# Altium schematic sheet main.SchDoc
size 581 x 513 mm; Origin: Eagle
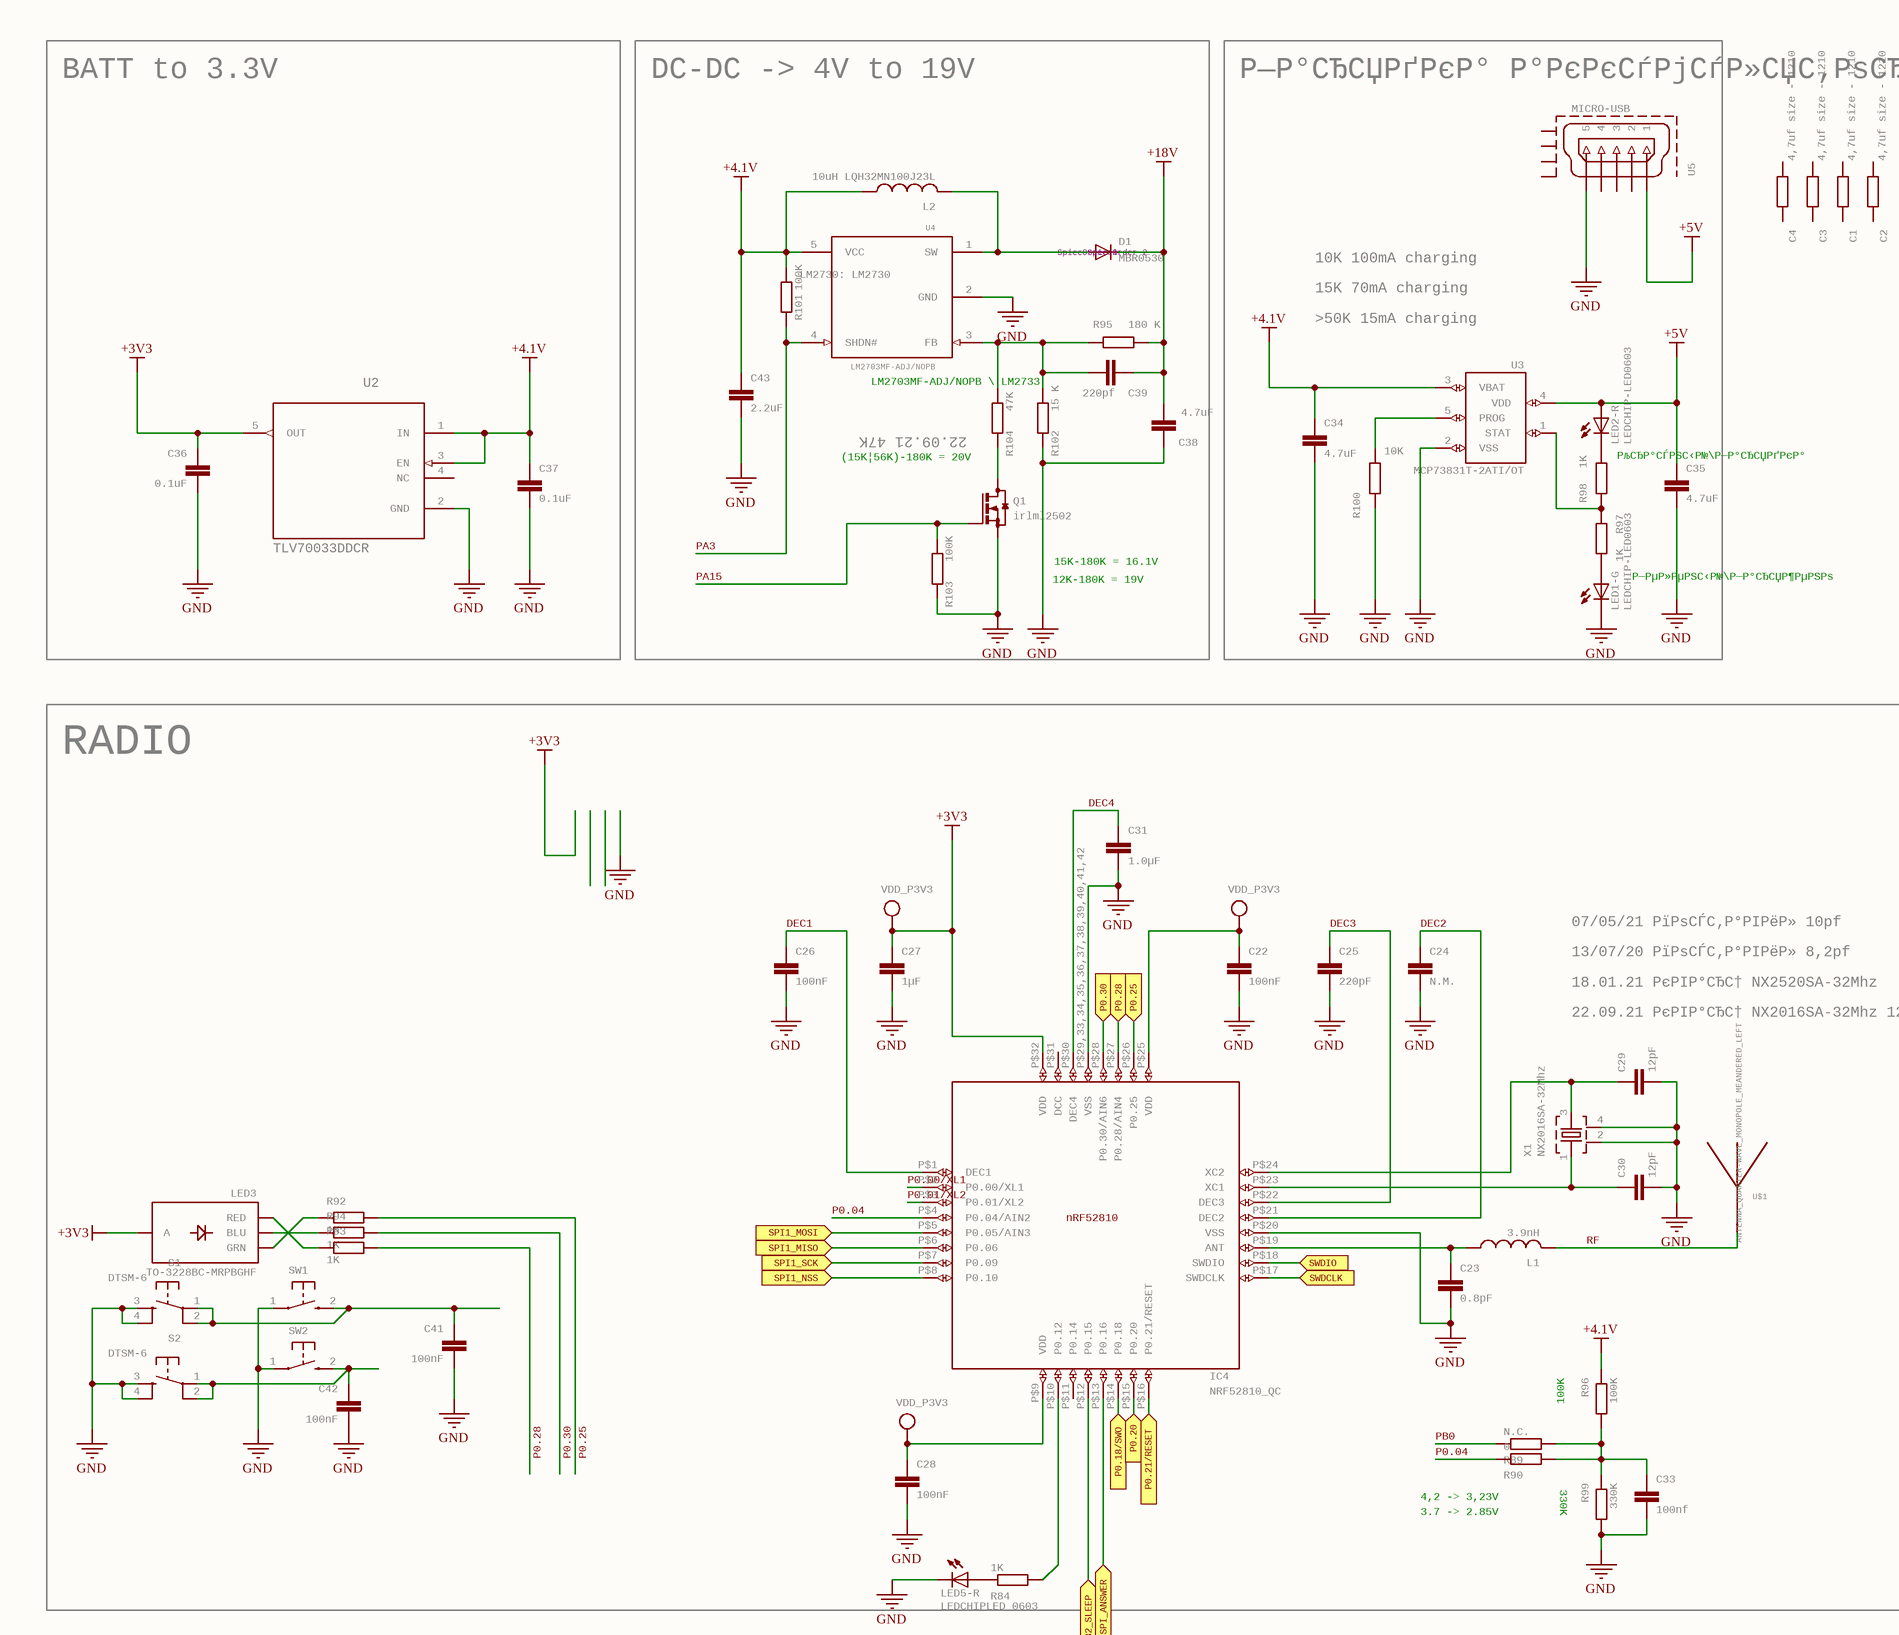
[diagram p0: main.SchDoc, top left]
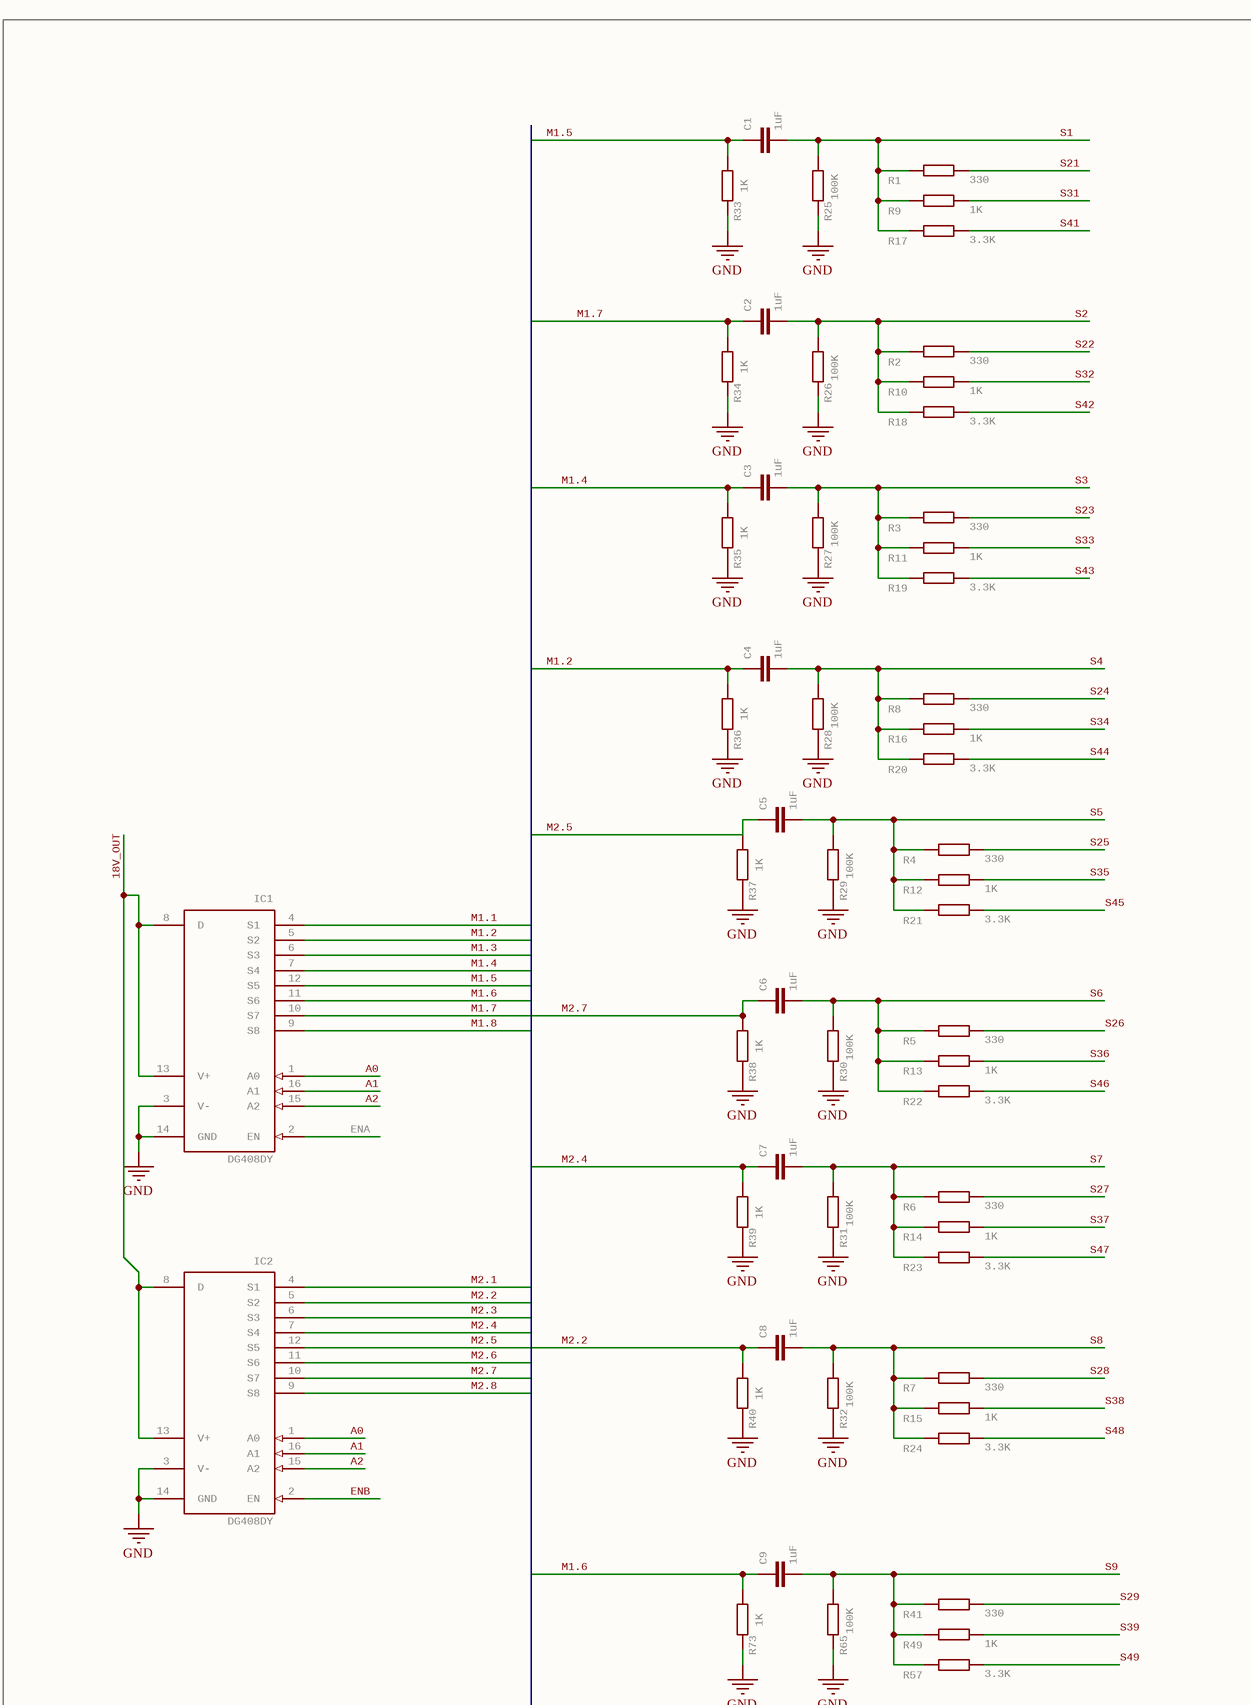
[diagram p1: main.SchDoc, top right]
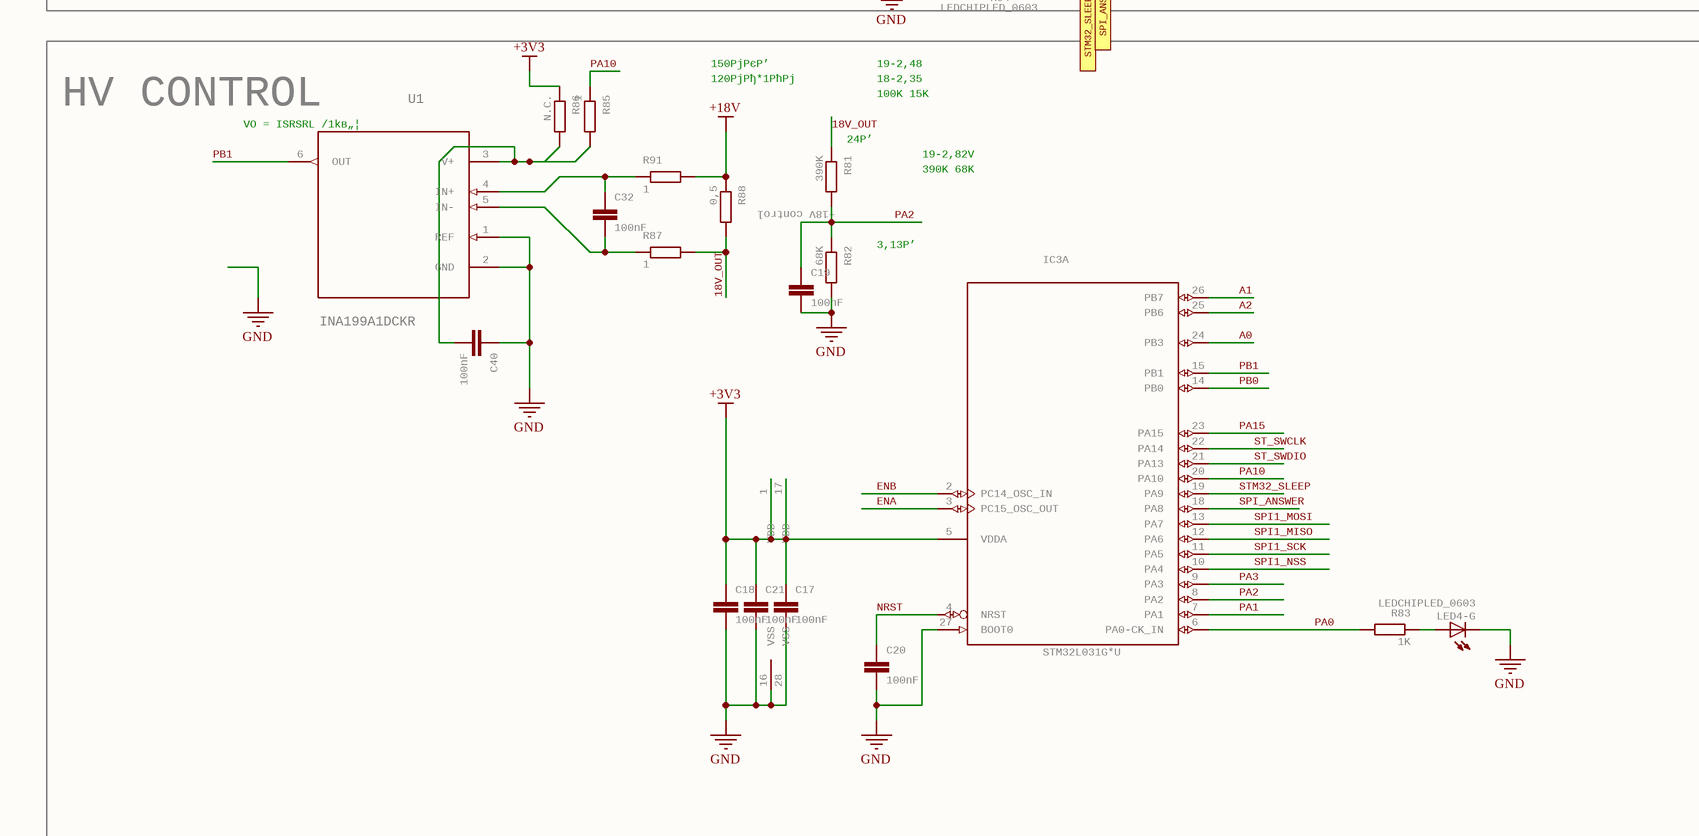
[diagram p2: main.SchDoc, bottom left]
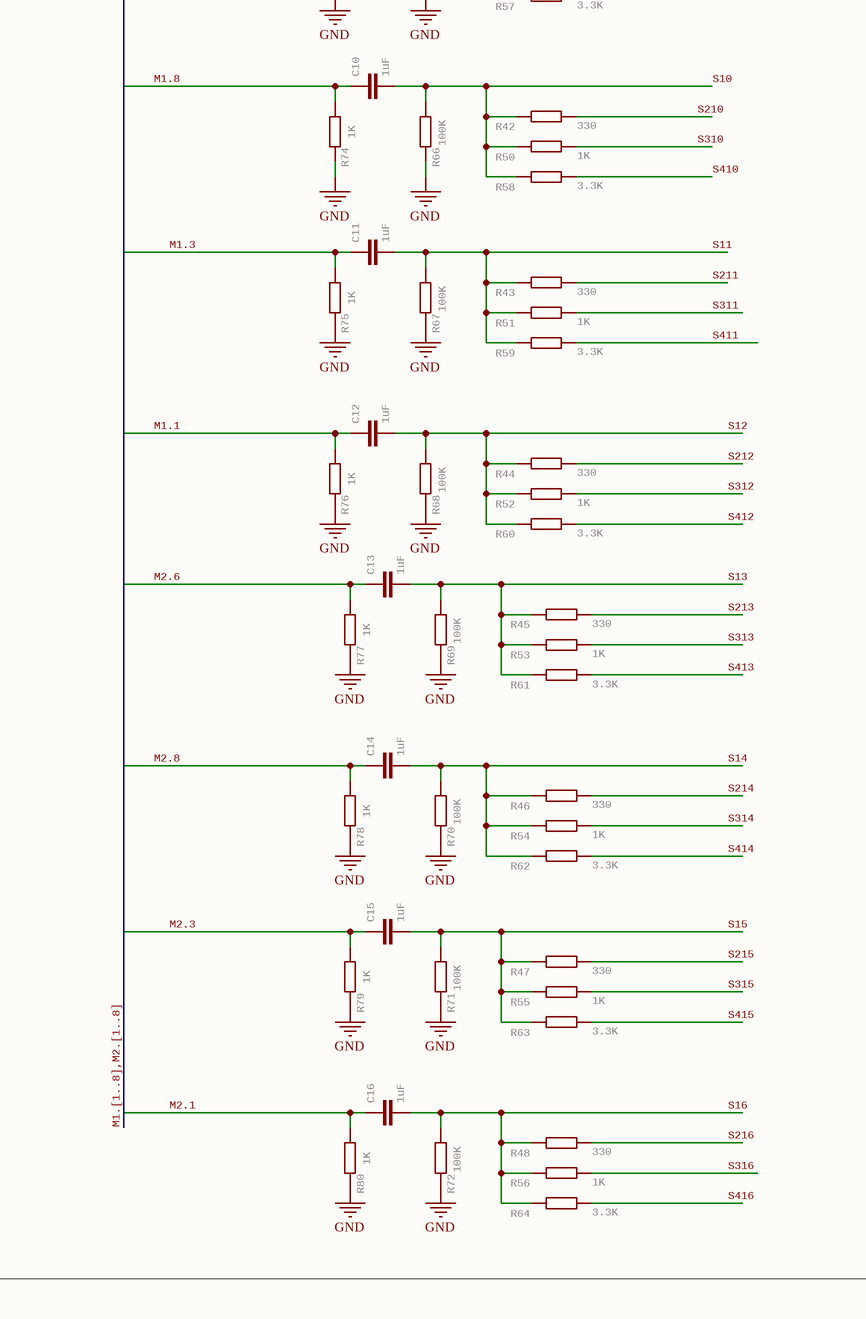
[diagram p3: main.SchDoc, bottom right]

## Parts
C1  1uF  [C0402]
C2  1uF  [C0402]
C3  1uF  [C0402]
C4  1uF  [C0402]
C5  1uF  [C0402]
C6  1uF  [C0402]
C7  1uF  [C0402]
C8  1uF  [C0402]
C9  1uF  [C0402]
C10  1uF  [C0402]
C11  1uF  [C0402]
C12  1uF  [C0402]
C13  1uF  [C0402]
C14  1uF  [C0402]
C15  1uF  [C0402]
C16  1uF  [C0402]
C17  100nF  [RESC0402_N]
C18  100nF  [RESC0402_N]
C19  100nF  [RESC0402_N]
C20  100nF  [RESC0402_N]
C21  100nF  [RESC0402_N]
C22  100nF  [RESC0402_N]
C23  0.8pF  [RESC0402_N]
C24  N.M.  [RESC0402_N]
C25  220pF  [RESC0402_N]
C26  100nF  [RESC0402_N]
C27  1µF  [RESC0603_N]
C28  100nF  [RESC0402_N]
C29  12pF  [RESC0402_N]
C30  12pF  [RESC0402_N]
C31  1.0µF  [RESC0402_M]
C32  100nF  [RESC0402_N]
C33  100nf  [RESC0402_N]
C34  4.7uF  [C0805K]
C35  4.7uF  [C0805K]
C36  0.1uF  [C0402]
C37  0.1uF  [C0402]
C38  4.7uF  [C0805K]
C39  220pf  [C0603K]
C40  100nF  [RESC0402_N]
C41  100nF  [RESC0402_N]
C42  100nF  [RESC0402_N]
C43  2.2uF  [C0805K]
D1  MBR0530  SpiceOrder1: SpiceOrder 1  SpiceOrder2: SpiceOrder 2  [SOD123]
IC1  DG408DY  [SO16]
IC2  DG408DY  [SO16]
IC3  STM32L031G*U  [UFQFPN28]  (parts A,B of 2)
IC4  NRF52810_QC  [QFN50P500X500X90-32_N]
L1  3.9nH  [RESC0402_N]
L2  10uH LQH32MN100J23L  [L2825P]
LED1-G  LEDCHIP-LED0603  [CHIP-LED0603]
LED2-R  LEDCHIP-LED0603  [CHIP-LED0603]
LED3  TO-3228BC-MRPBGHF  [LED-TRICOLOR-SMD]
LED4-G  LEDCHIPLED_0603  [CHIPLED_0603]
LED5-R  LEDCHIPLED_0603  [CHIPLED_0603]
Q1  irlml2502  [SOT23]
R1  330  [R0402]
R2  330  [R0402]
R3  330  [R0402]
R4  330  [R0402]
R5  330  [R0402]
R6  330  [R0402]
R7  330  [R0402]
R8  330  [R0402]
R9  1K  [R0402]
R10  1K  [R0402]
R11  1K  [R0402]
R12  1K  [R0402]
R13  1K  [R0402]
R14  1K  [R0402]
R15  1K  [R0402]
R16  1K  [R0402]
R17  3.3K  [R0402]
R18  3.3K  [R0402]
R19  3.3K  [R0402]
R20  3.3K  [R0402]
R21  3.3K  [R0402]
R22  3.3K  [R0402]
R23  3.3K  [R0402]
R24  3.3K  [R0402]
R25  100K  [R0402]
R26  100K  [R0402]
R27  100K  [R0402]
R28  100K  [R0402]
R29  100K  [R0402]
R30  100K  [R0402]
R31  100K  [R0402]
R32  100K  [R0402]
R33  1K  [R0402]
R34  1K  [R0402]
R35  1K  [R0402]
R36  1K  [R0402]
R37  1K  [R0402]
R38  1K  [R0402]
R39  1K  [R0402]
R40  1K  [R0402]
R41  330  [R0402]
R42  330  [R0402]
R43  330  [R0402]
R44  330  [R0402]
R45  330  [R0402]
R46  330  [R0402]
R47  330  [R0402]
R48  330  [R0402]
R49  1K  [R0402]
R50  1K  [R0402]
R51  1K  [R0402]
R52  1K  [R0402]
R53  1K  [R0402]
R54  1K  [R0402]
R55  1K  [R0402]
R56  1K  [R0402]
R57  3.3K  [R0402]
R58  3.3K  [R0402]
R59  3.3K  [R0402]
R60  3.3K  [R0402]
R61  3.3K  [R0402]
R62  3.3K  [R0402]
R63  3.3K  [R0402]
R64  3.3K  [R0402]
R65  100K  [R0402]
R66  100K  [R0402]
R67  100K  [R0402]
R68  100K  [R0402]
R69  100K  [R0402]
R70  100K  [R0402]
R71  100K  [R0402]
R72  100K  [R0402]
R73  1K  [R0402]
R74  1K  [R0402]
R75  1K  [R0402]
R76  1K  [R0402]
R77  1K  [R0402]
R78  1K  [R0402]
R79  1K  [R0402]
R80  1K  [R0402]
R81  390K  [R0402]
R82  68K  [R0402]
R83  1K  [R0603]
R84  1K  [R0603]
R85  1  [R0402]
R86  N.C.  [R0402]
R87  1  [R0402]
R88  0,5  [R0603]
R89  N.C.  [R0402]
R90  0  [R0402]
R91  1  [R0402]
R92  1K  [R0402]
R93  1K  [R0402]
R94  1K  [R0402]
R95  180 K  [R0603]
R96  100K  [R0402]
R97  1K  [R0603]
R98  1K  [R0603]
R99  330K  [R0402]
R100  10K  [R0402]
R101  100K  [R0402]
R102  15 K  [R0603]
R103  100K  [R0603]
R104  47K  [R0603]
S1  DTSM-6  [DTSM-6]
S2  DTSM-6  [DTSM-6]
SW1  KSS-2EG4430  [KSS-2EG4430]  (value not drawn)
SW2  KSS-2EG4430  [KSS-2EG4430]  (value not drawn)
U1  INA199A1DCKR  [SOT65P210X110-6N]
U2  TLV70033DDCR  [SOT95P280X110-5N]
U3  MCP73831T-2ATI/OT  [SOT23-5L]
U4  LM2703MF-ADJ/NOPB  [SOT23-5]
U5  MICRO-USB  [47589-0001]
U$1  ANTENNA_QUARTER-WAVE_MONOPOLE_MEANDERED_LEFT  [QWMP_MEANDERED_LEFT_+6]
VDD_NRF3  VDD_P3V3
VDD_NRF4  VDD_P3V3
VDD_NRF5  VDD_P3V3
X1  NX2016SA-32Mhz  [BT-XTAL_2016_N]
С1  4,7uf size - 1210  [R1206]
С2  4,7uf size - 1210  [R1206]
С3  4,7uf size - 1210  [R1206]
С4  4,7uf size - 1210  [R1206]

## Blocks framed on the sheet
BATT to 3.3V: C36 C37 U2
DC-DC -> 4V to 19V: C38 C39 C43 D1 L2 Q1 R95 R101-R104 U4
Р—Р°СЂСЏРґРєР° Р°РєРєСѓРјСѓР»СЏС‚РѕСЂР°: C34 C35 LED1-G LED2-R R97 R98 R100 U3 U5
ENA: C1-C16 IC1 IC2 R1-R80
RADIO: C22-C31 C33 C41 C42 IC4 L1 LED3 LED5-R R84 R89 R90 R92-R94 R96 R99 S1 S2 SW1 SW2 U$1 VDD_NRF3-VDD_NRF5 X1
HV CONTROL: C17-C21 C32 C40 IC3 LED4-G R81-R83 R85-R88 R91 U1

## Ports
P0.18/SWO (in), P0.20 (in), P0.21/RESET (in), P0.25 (in), P0.28 (in), P0.30 (in), SPI1_MISO (in), SPI1_MOSI (in), SPI1_NSS (in), SPI1_SCK (in), SPI_ANSWER (in), STM32_SLEEP (in), SWDCLK (in), SWDIO (in)

## Nets
+3V3: C17.1 C18.1 C21.1 C27.1 C36.1 IC3.1(VDD) IC3.5(VDDA) IC3.17(VDD) IC4.P$32(VDD) LED3.A R86.1 U2.5(OUT) VDD_NRF4.?1(VCC)
+4.1V: C34.1 C37.1 C43.1 L2.1 R96.1 R101.1 U2.1(IN) U2.3(EN) U3.3(VBAT) U4.5(VCC)
+5V: C35.1 LED2-R.A U3.4(VDD) U5.1
+18V: C38.2 C39.1 D1.C R88.1 R91.2 R95.1
GND: C17.2 C18.2 C19.2 C20.2 C21.2 C22.2 C23.2 C24.2 C25.2 C26.2 C27.2 C28.2 C29.2 C30.2 C31.2 C33.2 C34.2 C35.2 C36.2 C37.2 C38.1 C40.1 C41.2 C42.2 C43.2 IC1.3(V-) IC1.14(GND) IC2.3(V-) IC2.14(GND) IC3.16(VSS) IC3.27(BOOT0) IC3.28(VSS) IC4.P$20(VSS) IC4.P$29,33,34,35,36,37,38,39,40,41,42(VSS) LED1-G.C LED4-G.C LED5-R.C Q1.2(S) R25.1 R26.1 R27.1 R28.1 R29.1 R30.1 R31.1 R32.1 R33.1 R34.1 R35.1 R36.1 R37.1 R38.1 R39.1 R40.1 R65.1 R66.1 R67.1 R68.1 R69.1 R70.1 R71.1 R72.1 R73.1 R74.1 R75.1 R76.1 R77.1 R78.1 R79.1 R80.1 R82.2 R99.2 R100.2 R102.2 R103.2 S1.3 S1.4 S2.3 S2.4 SW1.1(P) SW2.1(P) U1.1(REF) U1.2(GND) U2.2(GND) U3.2(VSS) U4.2(GND) U5.5 X1.2 X1.4
18V_OUT: IC1.8(D) IC1.13(V+) IC2.8(D) IC2.13(V+) R81.1 R87.2 R88.2
A0: IC1.1(A0) IC2.1(A0) IC3.24(PB3)
A1: IC1.16(A1) IC2.16(A1) IC3.26(PB7)
A2: IC1.15(A2) IC2.15(A2) IC3.25(PB6)
DEC1: C26.1 IC4.P$1(DEC1)
DEC2: C24.1 IC4.P$21(DEC2)
DEC3: C25.1 IC4.P$22(DEC3)
DEC4: C31.1 IC4.P$30(DEC4)
ENA: IC3.3(PC15_OSC_OUT)
ENB: IC2.2(EN) IC3.2(PC14_OSC_IN)
M1.1: C12.1 IC1.4(S1) R76.2
M1.2: C4.1 IC1.5(S2) R36.2
M1.3: C11.1 IC1.6(S3) R75.2
M1.4: C3.1 IC1.7(S4) R35.2
M1.5: C1.1 IC1.12(S5) R33.2
M1.6: C9.1 IC1.11(S6) R73.2
M1.7: C2.1 C6.1 IC1.10(S7) IC2.10(S7) R34.2 R38.2  [also labelled M2.7]
M1.8: C10.1 IC1.9(S8) R74.2
M2.1: C16.1 IC2.4(S1) R80.2
M2.2: C5.1 C8.1 IC2.5(S2) IC2.12(S5) R37.2 R40.2  [also labelled M2.5]
M2.3: C15.1 IC2.6(S3) R79.2
M2.4: C7.1 IC2.7(S4) R39.2
M2.6: C13.1 IC2.11(S6) R77.2
M2.8: C14.1 IC2.9(S8) R78.2
NRST: C20.1 IC3.4(NRST)
P0.00/XL1: IC4.P$2(P0.00/XL1)
P0.01/XL2: IC4.P$3(P0.01/XL2)
P0.04: IC4.P$4(P0.04/AIN2) R90.1
P0.18/SWO: IC4.P$14(P0.18) ; port P0.18/SWO
P0.20: IC4.P$15(P0.20) ; port P0.20
P0.21/RESET: IC4.P$16(P0.21/RESET) ; port P0.21/RESET
P0.25: IC4.P$26(P0.25) ; port P0.25
P0.25: R92.2  [a separate net that carries the same name]
P0.28: IC4.P$27(P0.28/AIN4) ; port P0.28
P0.28: R93.2  [a separate net that carries the same name]
P0.30: IC4.P$28(P0.30/AIN6) ; port P0.30
P0.30: R94.2  [a separate net that carries the same name]
PA0: IC3.6(PA0-CK_IN) R83.2
PA1: IC3.7(PA1)
PA2: C19.1 IC3.8(PA2) R81.2 R82.1
PA3: IC3.9(PA3) R101.2 U4.4(SHDN#)
PA10: IC3.20(PA10) R85.1
PA15: IC3.23(PA15) Q1.1(G) R103.1
PB0: IC3.14(PB0) R89.1
PB1: IC3.15(PB1) U1.6(OUT)
RF: L1.2 U$1.P$1
S1: C1.2 R1.1 R9.1 R17.1 R25.2
S2: C2.2 R2.1 R10.1 R18.1 R26.2
S3: C3.2 R3.1 R11.1 R19.1 R27.2
S4: C4.2 R8.1 R16.1 R20.1 R28.2
S5: C5.2 R4.1 R12.1 R21.1 R29.2
S6: C6.2 R5.1 R13.1 R22.1 R30.2
S7: C7.2 R6.1 R14.1 R23.1 R31.2
S8: C8.2 R7.1 R15.1 R24.1 R32.2
S9: C9.2 R41.1 R49.1 R57.1 R65.2
S10: C10.2 R42.1 R50.1 R58.1 R66.2
S11: C11.2 R43.1 R51.1 R59.1 R67.2
S12: C12.2 R44.1 R52.1 R60.1 R68.2
S13: C13.2 R45.1 R53.1 R61.1 R69.2
S14: C14.2 R46.1 R54.1 R62.1 R70.2
S15: C15.2 R47.1 R55.1 R63.1 R71.2
S16: C16.2 R48.1 R56.1 R64.1 R72.2
S21: R1.2
S22: R2.2
S23: R3.2
S24: R8.2
S25: R4.2
S26: R5.2
S27: R6.2
S28: R7.2
S29: R41.2
S31: R9.2
S32: R10.2
S33: R11.2
S34: R16.2
S35: R12.2
S36: R13.2
S37: R14.2
S38: R15.2
S39: R49.2
S41: R17.2
S42: R18.2
S43: R19.2
S44: R20.2
S45: R21.2
S46: R22.2
S47: R23.2
S48: R24.2
S49: R57.2
S210: R42.2
S211: R43.2
S212: R44.2
S213: R45.2
S214: R46.2
S215: R47.2
S216: R48.2
S310: R50.2
S311: R51.2
S312: R52.2
S313: R53.2
S314: R54.2
S315: R55.2
S316: R56.2
S410: R58.2
S411: R59.2
S412: R60.2
S413: R61.2
S414: R62.2
S415: R63.2
S416: R64.2
SPI1_MISO: IC4.P$6(P0.06) ; port SPI1_MISO
SPI1_MISO: IC3.12(PA6)  [a separate net that carries the same name]
SPI1_MOSI: IC4.P$5(P0.05/AIN3) ; port SPI1_MOSI
SPI1_MOSI: IC3.13(PA7)  [a separate net that carries the same name]
SPI1_NSS: IC4.P$8(P0.10) ; port SPI1_NSS
SPI1_NSS: IC3.10(PA4)  [a separate net that carries the same name]
SPI1_SCK: IC4.P$7(P0.09) ; port SPI1_SCK
SPI1_SCK: IC3.11(PA5)  [a separate net that carries the same name]
SPI_ANSWER: IC4.P$13(P0.16) ; port SPI_ANSWER
SPI_ANSWER: IC3.18(PA8)  [a separate net that carries the same name]
ST_SWCLK: IC3.22(PA14)
ST_SWDIO: IC3.21(PA13)
STM32_SLEEP: IC4.P$12(P0.15) ; port STM32_SLEEP
STM32_SLEEP: IC3.19(PA9)  [a separate net that carries the same name]
SWDCLK: IC4.P$17(SWDCLK) ; port SWDCLK
SWDIO: IC4.P$18(SWDIO) ; port SWDIO
NetC22_1: C22.1 IC4.P$25(VDD) VDD_NRF5.?1(VCC)
NetC23_1: C23.1 IC4.P$19(ANT) L1.1
NetC28_1: C28.1 IC4.P$9(VDD) VDD_NRF3.?1(VCC)
NetC29_1: C29.1 IC4.P$24(XC2) X1.3
NetC30_1: C30.1 IC4.P$23(XC1) X1.1
NetC32_1: C32.1 R91.1 U1.4(IN+)
NetC32_2: C32.2 R87.1 U1.5(IN-)
NetC33_1: C33.1 R89.2 R90.2 R96.2 R99.1
NetC39_2: C39.2 R95.2 R102.1 R104.1 U4.3(FB)
NetC40_2: C40.2 R85.2 R86.2 U1.3(V+)
NetC41_1: C41.1 S1.1 S1.2 SW1.2(S)
NetC42_1: C42.1 S2.1 S2.2 SW2.2(S)
NetD1_A: D1.A L2.2 U4.1(SW)
NetIC4_P$10: IC4.P$10(P0.12) R84.2
NetLED1-G_A: LED1-G.A R97.1
NetLED2-R_C: LED2-R.C R98.1
NetLED3_B: LED3.B(BLU) R94.1
NetLED3_G: LED3.G(GRN) R92.1
NetLED3_R: LED3.R(RED) R93.1
NetLED4-G_A: LED4-G.A R83.1
NetLED5-R_A: LED5-R.A R84.1
NetQ1_3: Q1.3(D) R104.2
NetR97_2: R97.2 R98.2 U3.1(STAT)
NetR100_1: R100.1 U3.5(PROG)

Not connected (* = marked no-connect by the designer): IC1 2(EN); IC4 P$11(P0.14) P$31(DCC); U2 4(NC); U5 2 3 4 CASING1(GND1) CASING2(GND2) CASING3(GND3) CASING4(GND4); С1 1 2; С2 1 2; С3 1 2; С4 1 2

## Buses and harness runs
bus M1.[1..8],M2.[1..8]

## Notes on the sheet
- 10K 100mA charging
- >50K 15mA charging
- 15K 70mA charging
- (near R104) LM2703MF-ADJ/NOPB \ LM2733
- (15K|56K)-180K = 20V
- 22.09.21 47K
- РљСЂР°СЃРЅС‹Р№\Р—Р°СЂСЏРґРєР°
- 15K-180K = 16.1V
- 12K-180K = 19V
- Р—РµР»РµРЅС‹Р№\Р—Р°СЂСЏР¶РµРЅРѕ
- 07/05/21 РїРѕСЃС‚Р°РІРёР» 10pf
- 13/07/20 РїРѕСЃС‚Р°РІРёР» 8,2pf
- 18.01.21 РєРІР°СЂС† NX2520SA-32Mhz
- 22.09.21 РєРІР°СЂС† NX2016SA-32Mhz 12pf
- 100K
- 4,2 -> 3,23V
- 3.7 -> 2.85V
- 330K
- 150РјРєР’
- 120РјРђ*1РћРј
- 18-2,35
- 19-2,48
- 100K 15K
- (near U1) VO = ISRSRL /1kв„¦
- (near R81) 24Р’
- 19-2,82V
- 390K 68K
- (near R81) +18V control
- 3,13Р’

## Library data of the parts
C1-C16 C36 C37 = C-EUC0402: CAPACITOR, European symbol; GateName_1: G$1; SymbolName_1: C-EU; DeviceName: C0402; LibraryName: resistor; DeviceSetName: C-EU
C17-C26 C28-C30 C32 C33 C40-C42 = CAPACITOR_0402_N: Generic chip capacitor; GateName_1: C$1; SymbolName_1: C-EU; DeviceName: _0402_N; LibraryName: Nordic_nRF; DeviceSetName: CAPACITOR
C27 = CAPACITOR_0603_N: Generic chip capacitor; GateName_1: C$1; SymbolName_1: C-EU; DeviceName: _0603_N; LibraryName: Nordic_nRF; DeviceSetName: CAPACITOR
C31 = CAPACITOR_0402_M: Generic chip capacitor; GateName_1: C$1; SymbolName_1: C-EU; DeviceName: _0402_M; LibraryName: Nordic_nRF; DeviceSetName: CAPACITOR
C34 C35 C38 C43 = C-EUC0805K: CAPACITOR, European symbol; GateName_1: G$1; SymbolName_1: C-EU; DeviceName: C0805K; LibraryName: resistor; DeviceSetName: C-EU
C39 = C-EUC0603K: CAPACITOR, European symbol; GateName_1: G$1; SymbolName_1: C-EU; DeviceName: C0603K; LibraryName: resistor; DeviceSetName: C-EU
D1 = MBR0520LT: SCHOTTKY BARRIER RECTIFIER   Source: http://onsemi.com .. MBR0520LT1-D.pdf; GateName_1: G$1; SymbolName_1: D; LibraryName: diode; DeviceSetName: MBR0520LT
IC1 IC2 = DG408DY: ANALOG MULTIPLEXER; GateName_1: G$2; SymbolName_1: DG408; LibraryName: maxim-6a; DeviceSetName: DG408DY
IC3 = STM32L031G*U: ARM 32-bit Cortexв„ў-M0 CPU   48 MHz maximum frequency 16 to 32 Kbytes of Flash memory 4 kbytes of SRAM 23 GPIOs 2.0 to 3.6 V application supply; GateName_1: MCU; SymbolName_1: STM32_28PIN_TYP1; GateName_2: PWR; SymbolName_2: PWR_VDD1_VSS1; LibraryName: stm32l031g4; DeviceSetName: STM32L031G*U
IC4 = NRF52810_QC: nRF52810  Features  Single chip, highly flexible, 2.4 GHz multi-protocol SoC  32-bit ARM Cortex-M4 Processor  1.7v to 3.6v operation  192kB flash + 24kB RAM  Supports concurrent Bluetooth low energy/ANT protocol operation  Up to +4dBm output power  -96dBm sensitivity, Bluetooth low energy  Thread safe and run-time protected  Event driven API  On air compatible with nRF24L and nRF24AP series  2 data rates (2Mbps/1Mbps)  PPI - maximum flexibility for power-efficient applications and code simplification  Automated power management system with automatic power management of each peripheral  Configurable I/O mapping for analog and digital I/O  1 x Master/Slave SPI  1 x Two-wire interface (IВІC)  UART (RTS/CTS)  1 x PWM (4 channels)  AES HW encryption  8-channel 10/12-bit ADC  Quadrature decoder  64-level analog comparator  Real Time Counter (RTC)  Digital microphone interface (PDM)  On-chip balun     Applications  Bluetooth 5 connectivity processor  Industrial sensors and actuators  Wearables  SmartHome sensors  computer peripherals  RF smart remotes  Airfuel (A4WP) wireless charging  Beacons  Sports and fitness sensors   Connected health products  Smart watches  RC Toys  Interactive games  Building automation; GateName_1: G$1; SymbolName_1: NRF52810_QC; LibraryName: Nordic_nRF; DeviceSetName: NRF52810_QC; nRF52810: nRF52810
L1 = INDUCTOR_0402_N: Generic chip inductor; GateName_1: L$1; SymbolName_1: L-US; DeviceName: _0402_N; LibraryName: Nordic_nRF; DeviceSetName: INDUCTOR
L2 = L-USL2825P: INDUCTOR, American symbol; GateName_1: G$1; SymbolName_1: L-US; DeviceName: L2825P; LibraryName: rcl; DeviceSetName: L-US
LED1-G LED2-R = LEDCHIP-LED0603: LED   OSRAM: - CHIPLED LG R971, LG N971, LY N971, LG Q971, LY Q971, LO R971, LY R971 LH N974, LH R974 LS Q976, LO Q976, LY Q976 LO Q996 - Hyper CHIPLED LW Q18S LB Q993, LB Q99A, LB R99A - SideLED LS A670, LO A670, LY A670, LG A670, LP A670 LB A673, LV A673, LT A673, LW A673 LH A674 LY A675 LS A676, LA A676, LO A676, LY A676, LW A676 LS A679, LY A679, LG A679 -  Hyper Micro SIDELEDВ® LS Y876, LA Y876, LO Y876, LY Y876 LT Y87S - SmartLED LW L88C, LW L88S LB L89C, LB L89S, LG L890 LS L89K, LO L89K, LY L89K LS L896, LA L896, LO L896, LY L896 - TOPLED LS T670, LO T670, LY T670, LG T670, LP T670 LSG T670, LSP T670, LSY T670, LOP T670, LYG T670 LG T671, LOG T671, LSG T671 LB T673, LV T673, LT T673, LW T673 LH T674 LS T676, LA T676, LO T676, LY T676, LB T676, LH T676, LSB T676, LW T676 LB T67C, LV T67C, LT T67C, LS T67K, LO T67K, LY T67K, LW E67C LS E67B, LA E67B, LO E67B, LY E67B, LB E67C, LV E67C, LT E67C LW T67C LS T679, LY T679, LG T679 LS T770, LO T770, LY T770, LG T770, LP T770 LB T773, LV T773, LT T773, LW T773 LH T774 LS E675, LA E675, LY E675, LS T675 LS T776, LA T776, LO T776, LY T776, LB T776 LHGB T686 LT T68C, LB T68C - Hyper Mini TOPLEDВ® LB M676 - Mini TOPLED SantanaВ® LG M470 LS M47K, LO M47K, LY M47K    Source: http://www.osram.convergy.de   LUXEON: - LUMILEDВ® LXK2-PW12-R00, LXK2-PW12-S00, LXK2-PW14-U00, LXK2-PW14-V00 LXK2-PM12-R00, LXK2-PM12-S00, LXK2-PM14-U00 LXK2-PE12-Q00, LXK2-PE12-R00, LXK2-PE12-S00, LXK2-PE14-T00, LXK2-PE14-U00 LXK2-PB12-K00, LXK2-PB12-L00, LXK2-PB12-M00, LXK2-PB14-N00, LXK2-PB14-P00, LXK2-PB14-Q00 LXK2-PR12-L00, LXK2-PR12-M00, LXK2-PR14-Q00, LXK2-PR14-R00 LXK2-PD12-Q00, LXK2-PD12-R00, LXK2-PD12-S00 LXK2-PH12-R00, LXK2-PH12-S00 LXK2-PL12-P00, LXK2-PL12-Q00, LXK2-PL12-R00    Source: www.luxeon.com   KINGBRIGHT:   KA-3528ASYC Source: www.kingbright.com; GateName_1: G$1; SymbolName_1: LED; DeviceName: CHIP-LED0603; LibraryName: led; DeviceSetName: LED
LED3 = LED-RGB-CASMD: LED-RGB Diffused Common Anode     Packages:   LED RGB-THRU   P-LCC-4-3  LED-TRICOLOR-SMD    SparkFun Products: RGB Diffused Common Anode- Diffuse  RGB Diffused Common Anode - Clear  Qduino Mini  Triple Output LED RGB - SMD; GateName_1: G$1; PROD_ID: DIO-08324; SymbolName_1: LED-RGB-CA; DeviceName: SMD; LibraryName: SparkFun-LED; DeviceSetName: LED-RGB-CA
LED4-G LED5-R = LEDCHIPLED_0603: LED   OSRAM: - CHIPLED LG R971, LG N971, LY N971, LG Q971, LY Q971, LO R971, LY R971 LH N974, LH R974 LS Q976, LO Q976, LY Q976 LO Q996 - Hyper CHIPLED LW Q18S LB Q993, LB Q99A, LB R99A - SideLED LS A670, LO A670, LY A670, LG A670, LP A670 LB A673, LV A673, LT A673, LW A673 LH A674 LY A675 LS A676, LA A676, LO A676, LY A676, LW A676 LS A679, LY A679, LG A679 -  Hyper Micro SIDELEDВ® LS Y876, LA Y876, LO Y876, LY Y876 LT Y87S - SmartLED LW L88C, LW L88S LB L89C, LB L89S, LG L890 LS L89K, LO L89K, LY L89K LS L896, LA L896, LO L896, LY L896 - TOPLED LS T670, LO T670, LY T670, LG T670, LP T670 LSG T670, LSP T670, LSY T670, LOP T670, LYG T670 LG T671, LOG T671, LSG T671 LB T673, LV T673, LT T673, LW T673 LH T674 LS T676, LA T676, LO T676, LY T676, LB T676, LH T676, LSB T676, LW T676 LB T67C, LV T67C, LT T67C, LS T67K, LO T67K, LY T67K, LW E67C LS E67B, LA E67B, LO E67B, LY E67B, LB E67C, LV E67C, LT E67C LW T67C LS T679, LY T679, LG T679 LS T770, LO T770, LY T770, LG T770, LP T770 LB T773, LV T773, LT T773, LW T773 LH T774 LS E675, LA E675, LY E675, LS T675 LS T776, LA T776, LO T776, LY T776, LB T776 LHGB T686 LT T68C, LB T68C - Hyper Mini TOPLEDВ® LB M676 - Mini TOPLED SantanaВ® LG M470 LS M47K, LO M47K, LY M47K    Source: http://www.osram.convergy.de   LUXEON: - LUMILEDВ® LXK2-PW12-R00, LXK2-PW12-S00, LXK2-PW14-U00, LXK2-PW14-V00 LXK2-PM12-R00, LXK2-PM12-S00, LXK2-PM14-U00 LXK2-PE12-Q00, LXK2-PE12-R00, LXK2-PE12-S00, LXK2-PE14-T00, LXK2-PE14-U00 LXK2-PB12-K00, LXK2-PB12-L00, LXK2-PB12-M00, LXK2-PB14-N00, LXK2-PB14-P00, LXK2-PB14-Q00 LXK2-PR12-L00, LXK2-PR12-M00, LXK2-PR14-Q00, LXK2-PR14-R00 LXK2-PD12-Q00, LXK2-PD12-R00, LXK2-PD12-S00 LXK2-PH12-R00, LXK2-PH12-S00 LXK2-PL12-P00, LXK2-PL12-Q00, LXK2-PL12-R00    Source: www.luxeon.com   KINGBRIGHT:   KA-3528ASYC Source: www.kingbright.com; GateName_1: G$1; SymbolName_1: LED; DeviceName: CHIPLED_0603; LibraryName: led; DeviceSetName: LED
Q1 = IRLML_N_TYPE: N-CHANNEL MOS FET; GateName_1: G$1; SymbolName_1: N-MOS; LibraryName: main; DeviceSetName: IRLML_N_TYPE
R1-R82 R85-R87 R89-R94 R96 R99-R101 = R-EU_R0402: RESISTOR, European symbol; GateName_1: G$1; SymbolName_1: R-EU; DeviceSetName: R-EU_; DeviceName: R0402; LibraryName: resistor
R83 R84 R88 R95 R97 R98 R102-R104 = R-EU_R0603: RESISTOR, European symbol; GateName_1: G$1; SymbolName_1: R-EU; DeviceSetName: R-EU_; DeviceName: R0603; LibraryName: resistor
S1 S2 = DTSM-6: GateName_1: G$1; SymbolName_1: TS2; LibraryName: switch-tact; DeviceSetName: DTSM-6
SW1 SW2 = KSS-2EG4430: Size: 3x6mm  Height: 5mm from PCB  Rating: DC12v 50mA  Travel: 0.25В±0.10mm  Operating Force: 180В±50gf  Return Force: 60gf min  Contact resistance: 100m? max  Insulation resistance: 100M? min  Operating life?50,000 cycles; GateName_1: G$1; SymbolName_1: TS-2PIN; LibraryName: buttons; DeviceSetName: KSS-2EG4430
U1 = INA199A1DCKR: CURRENT SHUNT MONITOR; GateName_1: A; SymbolName_1: INA199A1DCKR; LibraryName: Texas Instruments_By_element14_Batch_1; DeviceSetName: INA199A1DCKR; MPN: INA199A1DCKR; OC_FARNELL: -; OC_NEWARK: 74R6382; PACKAGE: SC70-6; SUPPLIER: Texas Instruments
U2 = TLV70033DDCR: 200-mA, Low-IQ, Low-Dropout Regulator for Portable Devices; GateName_1: A; SymbolName_1: TLV70033DDCR; LibraryName: Texas Instruments_By_element14_Batch_1; DeviceSetName: TLV70033DDCR; MPN: TLV70033DDCR; OC_FARNELL: -; OC_NEWARK: 55R7468; PACKAGE: TSOT-23-5; SUPPLIER: Texas Instruments
U3 = MCP73831: Miniature Single-Cell, Fully Integrated Li-Ion, Li-Polymer Charge Management Controllers; GateName_1: G$1; SymbolName_1: MCP73831; LibraryName: mcp73831; DeviceSetName: MCP73831
U4 = LM2703: Micropower Step-up DC/DC Converter 350mA peak current limit; GateName_1: G$1; SymbolName_1: LM2703; LibraryName: vreg-pulse; DeviceSetName: LM2703; LM2730: LM2730
U5 = MICRO-USB-RECEPTACLE47589-0001: MICRO USB RECEPTACLES Micro-USB Receptacles, SMT, Lead-Free from MOLEX.  (C) 2014 Tomasz Boleslaw CEDRO, cederom@tlen.pl, http://www.tomek.cedro.info.  Version 0.1 (2014-01-17): Initial release. Version 0.2 (2014-02-06): Updated 47589-0001 footprint pins/pads/milling.  Following devices are included: 1. 47589-0001 Micro-USB AB Receptacle, Bottom Mount, SMT, Lead-Free (Technical Drawing).; GateName_1: G$1; SymbolName_1: MICRO-USB-AB-RECEPTACLE; DeviceName: 47589-0001; LibraryName: con-molex-usb; DeviceSetName: MICRO-USB-RECEPTACLE
U$1 = ANTENNA_QUARTER-WAVE_MONOPOLE_MEANDERED_LEFT: GateName_1: G$1; SymbolName_1: ANT; LibraryName: Nordic_misc; DeviceSetName: ANTENNA_QUARTER-WAVE_MONOPOLE_MEANDERED_LEFT
VDD_NRF3-VDD_NRF5 = VCC: SUPPLY SYMBOL; GateName_1: G$1; SymbolName_1: VCC; LibraryName: supply2; DeviceSetName: VCC
X1 = XTAL_32MHZ: GateName_1: X$1; SymbolName_1: XTAL_GND; LibraryName: Nordic_nRF; DeviceSetName: XTAL_32MHZ
С1-С4 = R-EU_R1206: RESISTOR, European symbol; GateName_1: G$1; SymbolName_1: R-EU; DeviceSetName: R-EU_; DeviceName: R1206; LibraryName: resistor